# Altium schematic sheet Navigator_Components.SchDoc
size A; DocumentNumber: 4; SheetNumber: 4; SheetTotal: 8; PageSetup: Record=PageOptions|CenterHorizontal=True|CenterVertical=True|PrintScale=1.12|XCorrection=1.00|YCorrection=1.00|PrintKind=0|BorderSize=5000000|LeftOffset=0|BottomOffset=0|Orientation=2|PaperLength=1000|PaperWidth=1000|Scale=100|PaperSource=7|PrintQuality=-4|MediaType=1|DitherType=10|PaperKind=Letter|PrintScaleMode=1
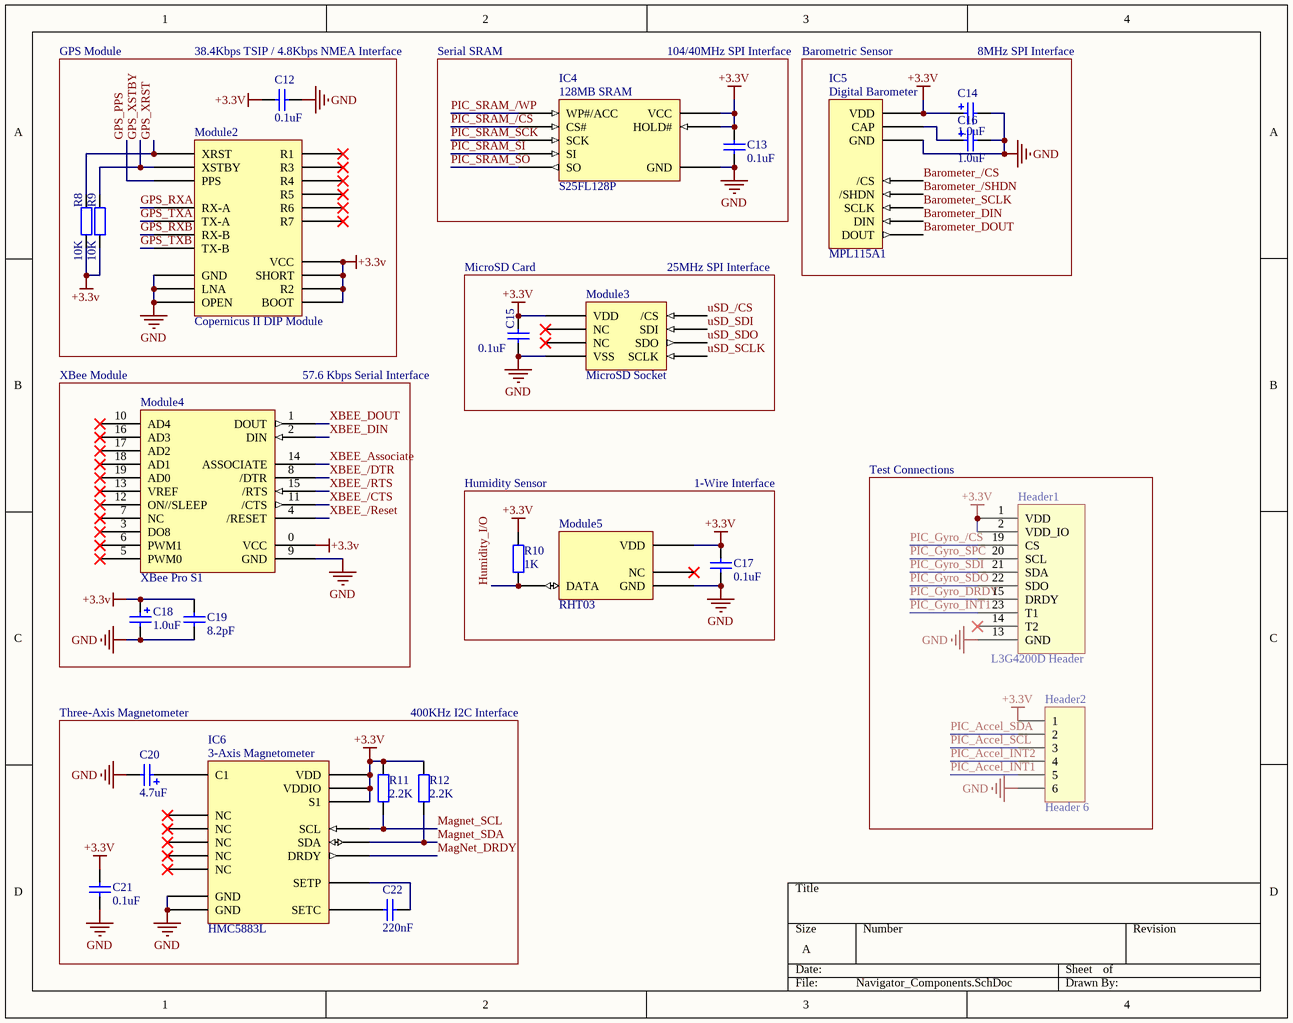
[diagram p0: Navigator_Components.SchDoc]

## Parts
C12  value 0.1uF  [SMD 1206]  (hidden comment: 0.1uF SMD 1206)
C13  value 0.1uF  [SMD 1206]  (hidden comment: 0.1uF SMD 1206)
C14  value 1.0uF  [Capacitor - Tantalum Case A]  (hidden comment: 1.0uF Low-ESR Tantalum CaseA)
C15  value 0.1uF  [SMD 1206]  (hidden comment: 0.1uF SMD 1206)
C16  value 1.0uF  [Capacitor - Tantalum Case A]  (hidden comment: 1.0uF Low-ESR Tantalum CaseA)
C17  value 0.1uF  [SMD 1206]  (hidden comment: 0.1uF SMD 1206)
C18  value 1.0uF  [Capacitor - Tantalum Case A]  (hidden comment: 1.0uF Low-ESR Tantalum CaseA)
C19  value 8.2pF  [SMD 0805]  (hidden comment: 8.2pF SMD 0805)
C20  value 4.7uF  [Capacitor - Tantalum Case A]  (hidden comment: 4.7uF Low-ESR Tantalum CaseA)
C21  value 0.1uF  [SMD 1206]  (hidden comment: 0.1uF SMD 1206)
C22  value 220nF  [SMD 0603]  (hidden comment: 220nF SMD 0603)
Header1  L3G4200D Header  [DIP24]
Header2  Header 6  [HDR1X6]
IC4  S25FL128P  [S25FL128P]
IC5  MPL115A1  [MPL115A1]
IC6  HMC5883L  [HMC5883L-TR]
Module2  Copernicus II DIP Module  [Copernicus GPS Module]
Module3  MicroSD Socket  [MicroSD Card Slot]
Module4  XBee Pro S1  [XBee Pro S1 Wireless Module]
Module5  RHT03  [RHT03 Humidity Sensor]
R8  value 10K  [SMD 0805]  (hidden comment: 10K SMD 0805)
R9  value 10K  [SMD 0805]  (hidden comment: 10K SMD 0805)
R10  value 1K  [SMD 0805]  (hidden comment: 1K SMD 0805)
R11  value 2.2K  [SMD 0805]  (hidden comment: 2.2K SMD 0805)
R12  value 2.2K  [SMD 0805]  (hidden comment: 2.2K SMD 0805)

## Blocks framed on the sheet
Test Connections: Header1 Header2

## Nets
+3.3v: C12.1 C13.1 C14.1(+) C15.2 C17.1 C18.1(+) C19.2 C21.1 Header1.1(VDD) Header1.2(VDD_IO) Header2.1 IC4.6(HOLD#) IC4.7(VCC) IC5.0(VDD) IC6.1(VDD) IC6.3(S1) IC6.12(VDDIO) Module2.3(SHORT) Module2.4(R2) Module2.5(BOOT) Module2.7(VCC) Module3.3(VDD) Module4.0(VCC) Module5.0(VDD) R8.1 R9.1 R10.2 R11.2 R12.2
GND: C12.2 C13.2 C14.2(-) C15.1 C16.2(-) C17.2 C18.2(-) C19.1 C20.2(-) C21.2 Header1.13(GND) Header2.6 IC4.3(GND) IC5.2(GND) IC6.8(GND) IC6.10(GND) Module2.0(LNA) Module2.2(OPEN) Module2.8(GND) Module3.5(VSS) Module4.9(GND) Module5.3(GND)
Barometer_/CS: IC5.4(/CS)
Barometer_/SHDN: IC5.3(/SHDN)
Barometer_DIN: IC5.6(DIN)
Barometer_DOUT: IC5.5(DOUT)
Barometer_SCLK: IC5.7(SCLK)
GPS_PPS: Module2.12(PPS)
GPS_RXA: Module2.14(RX-A)
GPS_RXB: Module2.13(RX-B)
GPS_TXA: Module2.16(TX-A)
GPS_TXB: Module2.17(TX-B)
GPS_XRST: Module2.6(XRST) R8.2
GPS_XSTBY: Module2.9(XSTBY) R9.2
Humidity_I/O: Module5.1(DATA) R10.1
MagNet_DRDY: IC6.14(DRDY)
Magnet_SCL: IC6.0(SCL) R11.1
Magnet_SDA: IC6.15(SDA) R12.1
PIC_Accel_INT1: Header2.5
PIC_Accel_INT2: Header2.4
PIC_Accel_SCL: Header2.3
PIC_Accel_SDA: Header2.2
PIC_Gyro_/CS: Header1.19(CS)
PIC_Gyro_DRDY: Header1.15(DRDY)
PIC_Gyro_INT1: Header1.23(T1)
PIC_Gyro_SDI: Header1.21(SDA)
PIC_Gyro_SDO: Header1.22(SDO)
PIC_Gyro_SPC: Header1.20(SCL)
PIC_SRAM_/CS: IC4.0(CS#)
PIC_SRAM_/WP: IC4.2(WP#/ACC)
PIC_SRAM_SCK: IC4.5(SCK)
PIC_SRAM_SI: IC4.4(SI)
PIC_SRAM_SO: IC4.1(SO)
uSD_/CS: Module3.1(/CS)
uSD_SCLK: Module3.4(SCLK)
uSD_SDI: Module3.2(SDI)
uSD_SDO: Module3.6(SDO)
XBEE_/CTS: Module4.11(/CTS)
XBEE_/DTR: Module4.8(/DTR)
XBEE_/Reset: Module4.4(/RESET)
XBEE_/RTS: Module4.15(/RTS)
XBEE_Associate: Module4.14(ASSOCIATE)
XBEE_DIN: Module4.2(DIN)
XBEE_DOUT: Module4.1(DOUT)
NetC16_1: C16.1(+) IC5.1(CAP)
NetC20_1: C20.1(+) IC6.9(C1)
NetC22_1: C22.1 IC6.11(SETC)
NetC22_2: C22.2 IC6.7(SETP)

Not connected (* = marked no-connect by the designer): Header1 3(1) 4(2) 5(3) 6(4) 7(5) 8(6) 9(7) 10(8) 11(9) 12(10) 14(T2)* 16(11) 17(12) 18(13) 24(14); IC6 2(NC)* 4(NC)* 5(NC)* 6(NC)* 13(NC)*; Module2 1(R1)* 10(R3)* 11(R4)* 15(R5)* 18(R6)* 19(R7)*; Module3 0(NC)* 7(NC)*; Module4 3(DO8)* 5(PWM0)* 6(PWM1)* 7(NC)* 10(AD4)* 12(ON//SLEEP)* 13(VREF)* 16(AD3)* 17(AD2)* 18(AD1)* 19(AD0)*; Module5 2(NC)*

## Notes on the sheet
- GPS Module
- (near C12) 38.4Kbps TSIP / 4.8Kbps NMEA Interface
- Serial SRAM
- 104/40MHz SPI Interface
- Barometric Sensor
- 8MHz SPI Interface
- MicroSD Card
- (near Module3) 25MHz SPI Interface
- (near Module4) XBee Module
- 57.6 Kbps Serial Interface
- Humidity Sensor
- 1-Wire Interface
- Three-Axis Magnetometer
- 400KHz I2C Interface
- (in symbol HMC5883L) 3-Axis Magnetometer
- (in symbol MPL115A1) Digital Barometer
- (in symbol S25FL128P) 128MB SRAM

## Library data of the parts
C12 C13 C15 C17 C19 C21 C22 = Cap: Capacitor
C14 C16 C18 C20 = SMD_Cap_Tantalum: Tantalum Capacitor - Case A
Header2 = Header 6: Header, 6-Pin; LatestRevisionDate: 17-Jul-2002; LatestRevisionNote: Re-released for DXP Platform.; Publisher: Altium Limited
IC4 = S25FL128P: 128MB 104-MHz SPI Flash Memory; pin to pad: 0>1 1>2 2>3 3>4 4>5 5>6 6>7 7>8
IC5 = MPL115A1: Miniature SPI Digital Barometer; pin to pad: 0>1 1>2 2>3 3>4 4>5 5>6 6>7 7>8
IC6 = HMC5883L: 3-Axis Digital Compass IC; pin to pad: 0>1 1>2 2>3 3>4 4>5 5>6 6>7 7>8 8>9 9>10 10>11 11>12 12>13 13>14 14>15 15>16
Module2 = Copernicus II DIP Module: pin to pad: 0>1 1>2 2>3 3>4 4>5 5>6 6>7 7>8 8>9 9>10 10>11 11>12 12>13 13>14 14>15 15>16 16>17 17>18 18>19 19>20
Module3 = MicroSD Socket: MicroSD SPI Interface; pin to pad: 0>1 1>2 2>3 3>4 4>5 5>6 6>7 7>8; Supplier 1: Digi-Key
Module4 = XBee Pro S1: XBee Pro S1 60mW Wireless Module; pin to pad: 0>1 1>2 2>3 3>4 4>5 5>6 6>7 7>8 8>9 9>10 10>11 11>12 12>13 13>14 14>15 15>16 16>17 17>18 18>19 19>20
Module5 = RHT03: Digital Humidity & Temp Sensor; pin to pad: 0>1 1>2 2>3 3>4
R8-R12 = Res2: Resistor